# EAGLE design ECAM03 (EAGLE 7.4.0)
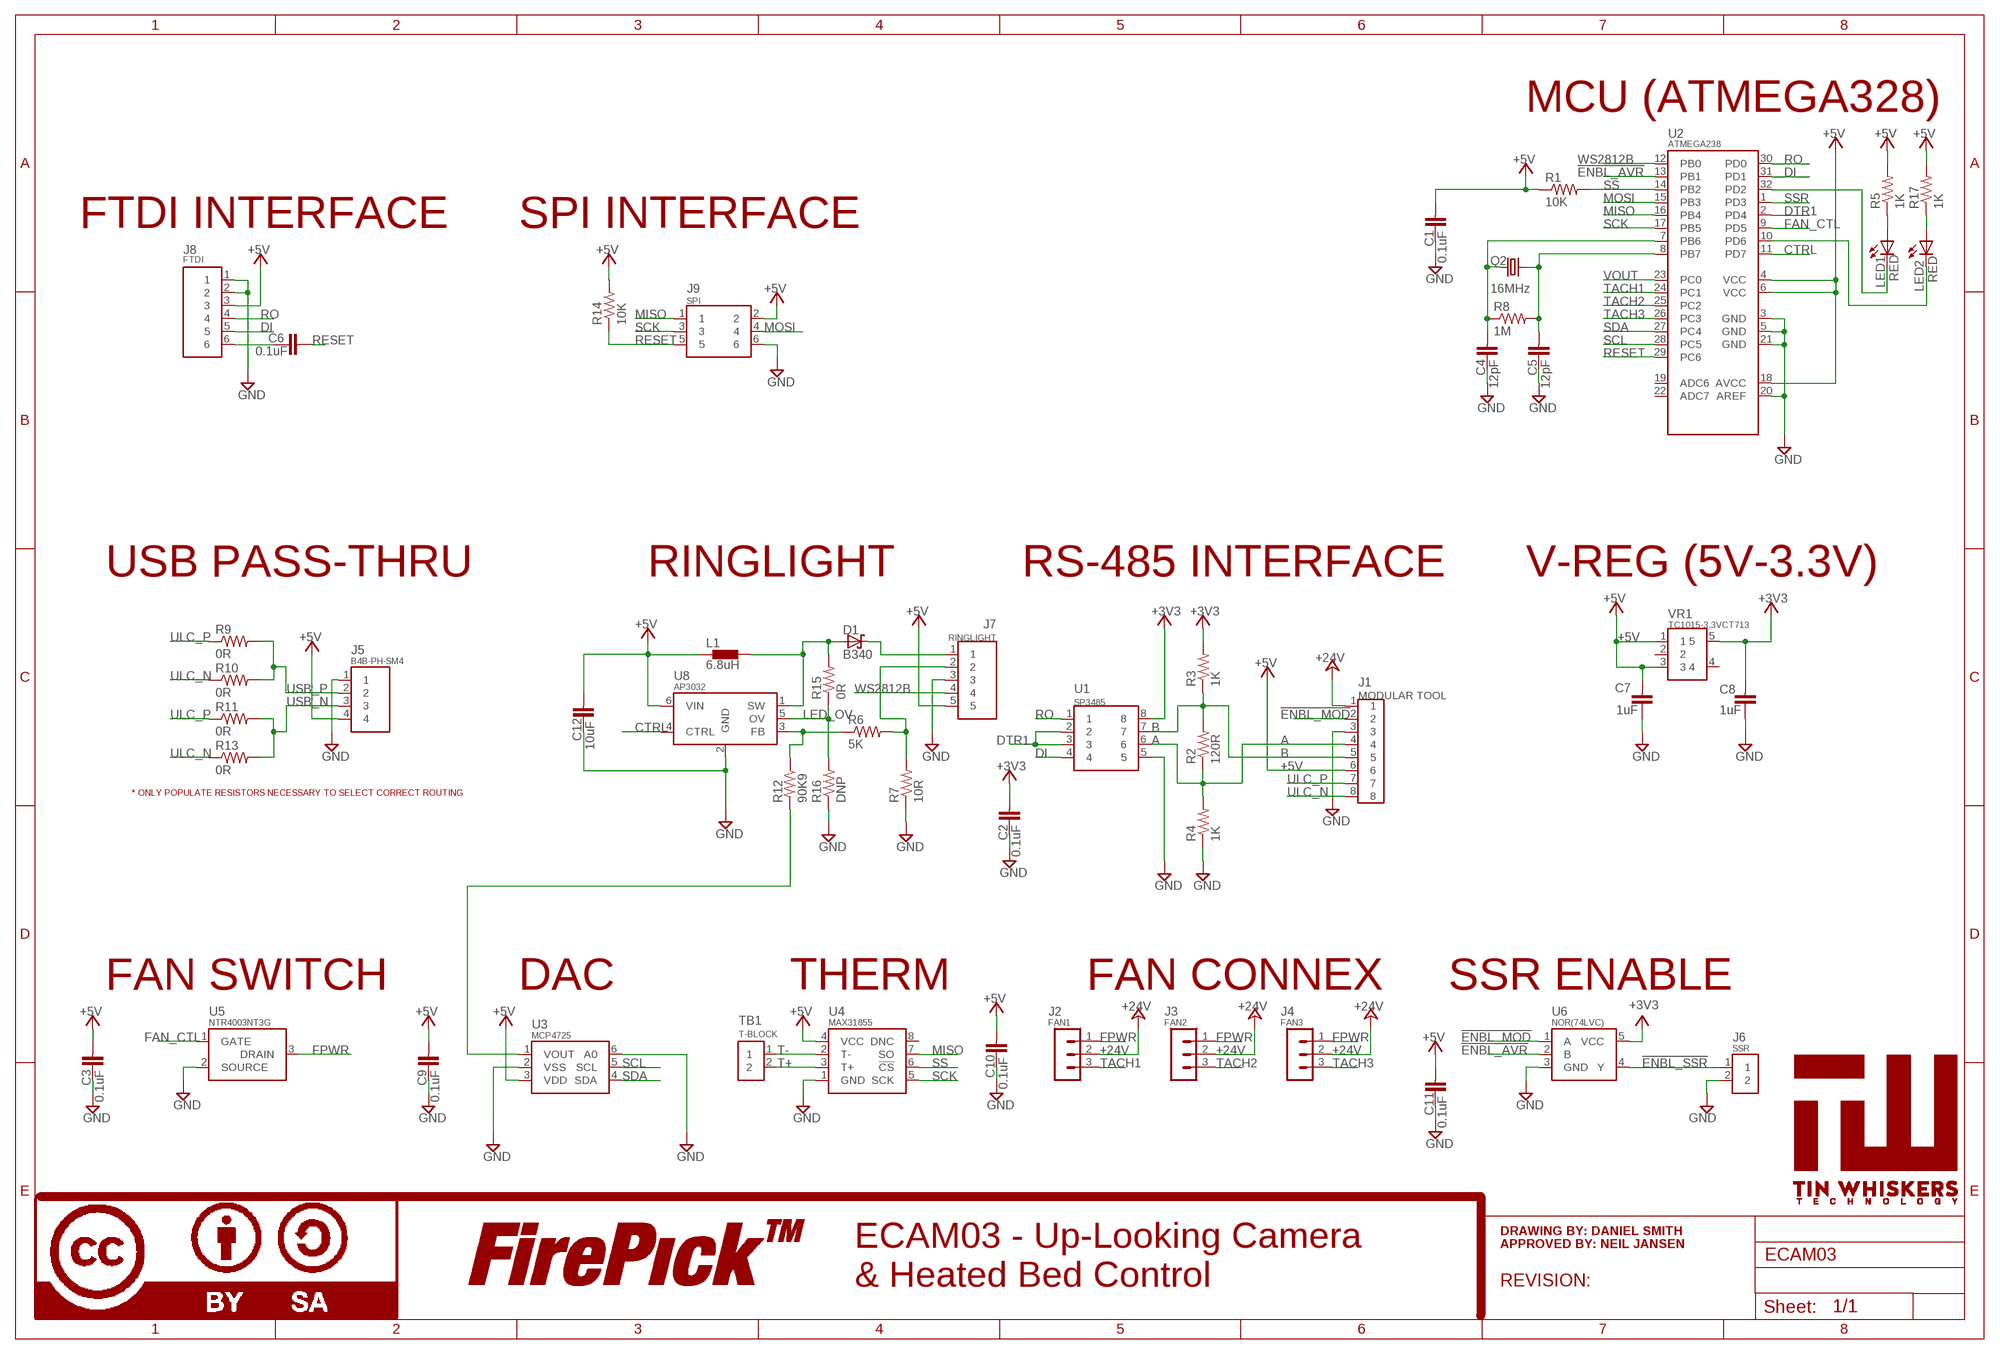
[diagram p0: schematic, sheet 1]

## Parts
C1  0.1uF  CPL-CAP-X5R-0603-0.1UF-35V  [C0603]
C2  0.1uF  CPL-CAP-X5R-0603-0.1UF-35V  [C0603]
C3  0.1uF  CPL-CAP-X5R-0603-0.1UF-35V  [C0603]
C4  12pF  CPL-CAP-C0G-0603-12PF-50V  [C0603]
C5  12pF  CPL-CAP-C0G-0603-12PF-50V  [C0603]
C6  0.1uF  CPL-CAP-X7R-0603-100NF-50V  [C0603]
C7  1uF  CPL-CAP-X5R-0603-1UF-50V  [C0603]
C8  1uF  CPL-CAP-X5R-0603-1UF-50V  [C0603]
C9  0.1uF  CPL-CAP-X5R-0603-0.1UF-35V  [C0603]
C10  0.1uF  CPL-CAP-X5R-0603-0.1UF-35V  [C0603]
C11  0.1uF  CPL-CAP-X5R-0603-0.1UF-35V  [C0603]
C12  10uF  CPL-CAP-X5R-0603-10UF-25V  [C0603]
D1  B340  CPL-DIO-B340-13-F-SMA  [DIO-SMA]
J1  MODULAR TOOL  CPL-CON-JST-2.0MM-8P-M-RA  [CONN-JST-PH-2.0MM-8P-SMT-RA]
J2  FAN1  CONN-RECT-3PINMOLEX-KK  [CONN-MOLEX-KK-3PIN]
J3  FAN2  CONN-RECT-3PINMOLEX-KK  [CONN-MOLEX-KK-3PIN]
J4  FAN3  CONN-RECT-3PINMOLEX-KK  [CONN-MOLEX-KK-3PIN]
J5  B4B-PH-SM4  CPL-CON-JST-2.0MM-4P-M-SMT-VRT  [CON-JST-PH-2.0MM-4P-SMT-VRT]
J6  SSR  CPL-CON-HEADER-0.1IN-2P-M  [CON-HDR-2POS-MALE]
J7  RINGLIGHT  CPL-CON-JST-2.0MM-5P-SMT-VRT  [CON-JST-PH-2.0MM-5P-SMT-VRT]
J8  FTDI  CPL-CON-HEADER-0.1IN-6P-M  [CON-HDR-6POS-MALE]
J9  SPI  CPL-CON-HEADER-0.1IN-2X3P-M  [CON-HDR-2X3P]
L1  6.8uH  CPL-IND-6.8UH-250MA  [0603]
LED1  RED  CPL-LED-0603-RED  [LED0603]
LED2  RED  CPL-LED-0603-RED  [LED0603]
LOGO1  LOGO-CC-BY-SALARGE  [LOGO-CC-BY-SA]
LOGO2  LOGO-FIREPICKLARGE  [LOGO-FIREPICK]
Q2  16MHz  CPL-OSC-CRY-16MHZ-18PF  [HC-49/U-S]
R1  10K  CPL-RES-0603-10K-0.1W  [R0603]
R2  120R  CPL-RES-0603-120-0.1W  [R0603]
R3  1K  CPL-RES-0603-1K-0.1W  [R0603]
R4  1K  CPL-RES-0603-1K-0.1W  [R0603]
R5  1K  CPL-RES-0603-1K-0.1W  [R0603]
R6  5K  CPL-RES-0603-5K-0.1W  [R0603]
R7  10R  CPL-RES-1206-10-0.25W1206  [R1206]
R8  1M  CPL-RES-0603-1M-0.1W  [R0603]
R9  0R  CPL-RES-0603-0-0.1W  [R0603]
R10  0R  CPL-RES-0603-0-0.1W  [R0603]
R11  0R  CPL-RES-0603-0-0.1W  [R0603]
R12  90K9  CPL-RES-0603-90K-0.1W  [R0603]
R13  0R  CPL-RES-0603-0-0.1W  [R0603]
R14  10K  CPL-RES-0603-10K-0.1W  [R0603]
R15  0R  CPL-RES-0603-0-0.1W  [R0603]
R16  DNP  CPL-RES-0603-0-0.1W  [R0603]
R17  1K  CPL-RES-0603-1K-0.1W  [R0603]
TB1  T-BLOCK  CPL-TBLK-SCR-2CKT-5.0MM-OST  [TBLOCK-2-5MM-OSTTH020160]
U1  SP3485  [SOICN-8]
U2  ATMEGA238  CPL-MCU-ATMEL-AT328-32TQFP  [32-TQF(ATMEGA)]
U3  MCP4725  CPL-DAC-12BIT-SOT23  [SOT-23-6]
U4  MAX31855  CPL-THRM-MAX31855  [SOICN-8]
U5  NTR4003NT3G  CPL-MOSFET-NCH-SOT23NTR4003N  [SOT-23-3]
U6  NOR(74LVC)  CPL-IC-LOGIC-NOR-1CH-74LVC  [SOT-23-5]
U8  AP3032  CPL-LED-DRIVER-WHT-AP3032  [SOT-23-6]
U$1  TIN-WHISKERSTSTOP  [TIN-WHISKERS-TSTOP]
VR1  TC1015-3.3VCT713  CPL-REG-LIN-3.3V-0.1A  [SOT-23-5]

## Nets
!ENBL_AVR: U2.13(PB1) U6.2(B)
!ENBL_MOD: J1.2 U6.1(A)
!ENBL_SSR: J6.1 U6.4(Y)
+3V3: C2.2 C8.2 R3.2 U1.8 U6.5(VCC) VR1.5
+5V: C1.2 C3.2 C7.2 C9.2 C10.2 C11.2 C12.2 J1.6 J5.4 J7.5 J8.3 J9.2 L1.1 R1.1 R5.2 R14.2 R17.2 U2.4(VCC) U2.6(VCC) U2.18(AVCC) U3.3(VDD) U4.4(VCC) U8.6(VIN) VR1.1 VR1.3
+24V: J1.1 J2.2 J3.2 J4.2
A: J1.4 R2.1 R4.2 U1.6
B: J1.5 R2.2 R3.1 U1.7
CTRL: U2.11(PD7) U8.4(CTRL)
DI: J8.5 U1.4 U2.31(PD1)
DTR1: U1.2 U1.3 U2.2(PD4)
FAN_CTL: U2.9(PD5) U5.1(GATE)
FPWR: J2.1 J3.1 J4.1 U5.3(DRAIN)
GND: C1.1 C2.1 C3.1 C4.1 C5.1 C7.1 C8.1 C9.1 C10.1 C11.1 C12.1 J1.3 J5.1 J6.2 J7.3 J8.1 J8.2 J9.6 R4.1 R7.1 R16.1 U1.5 U2.3(GND) U2.5(GND) U2.20(AREF) U2.21(GND) U3.2(VSS) U3.6(A0) U4.1(GND) U5.2(SOURCE) U6.3(GND) U8.2(GND)
LED_+: D1.NEG(C) J7.1
LED_-: J7.2 R6.2 R7.2
LED_FB: R6.1 R12.1 U8.3(FB)
LED_OV: R15.1 R16.2 U8.5(OV)
LED_SW: D1.POS(A) L1.2 R15.2 U8.1(SW)
MISO: J9.1 U2.16(PB4) U4.7(SO)
MOSI: J9.4 U2.15(PB3)
N$1: LED2.A R17.1
N$2: LED1.A R5.1
N$3: LED1.C U2.32(PD2)
N$4: LED2.C U2.10(PD6)
N$5: R12.2 U3.1(VOUT)
N$16: C6.1 J8.6
RESET: C6.2 J9.5 R14.1 U2.29(PC6)
RO: J8.4 U1.1 U2.30(PD0)
SCK: J9.3 U2.17(PB5) U4.5(SCK)
SCL: U2.28(PC5) U3.5(SCL)
SDA: U2.27(PC4) U3.4(SDA)
SS: R1.2 U2.14(PB2) U4.6(!CS)
SSR: U2.1(PD3)
T+: TB1.2 U4.3(T+)
T-: TB1.1 U4.2(T-)
TACH1: J2.3 U2.24(PC1)
TACH2: J3.3 U2.25(PC2)
TACH3: J4.3 U2.26(PC3)
ULC_N: J1.8 R10.1 R13.1
ULC_P: J1.7 R9.1 R11.1
USB_N: J5.3 R11.2 R13.2
USB_P: J5.2 R9.2 R10.2
VOUT: U2.23(PC0)
WS2812B: J7.4 U2.12(PB0)
XTAL1: C4.2 Q2.1 R8.1 U2.7(PB6)
XTAL2: C5.2 Q2.2 R8.2 U2.8(PB7)
Unconnected: U2.19(ADC6) U2.22(ADC7) U4.8(DNC) VR1.2 VR1.4

## Notes on the sheet
- MCU (ATMEGA328)
- FTDI INTERFACE | SPI INTERFACE
- SPI
- USB PASS-THRU | RINGLIGHT | RS-485 INTERFACE | V-REG (5V-3.3V)
- * ONLY POPULATE RESISTORS NECESSARY TO SELECT CORRECT ROUTING
- FAN SWITCH | DAC | THERM | FAN CONNEX | SSR ENABLE
- DRAWING BY: DANIEL SMITH
- APPROVED BY: NEIL JANSEN
- ECAM03 - Up-Looking Camera
  & Heated Bed Control
- REVISION:

## Library data of the parts
C1-C3 C9-C11 = TinWhiskers:CPL-CAP-X5R-0603-0.1UF-35V: Capacitor: 0.1uF, 35V, 10%, X5R; Package: 0603; Datasheet: http://www.yuden.co.jp/productdata/catalog/en/mlcc01_hq_e.pdf
C4 C5 = TinWhiskers:CPL-CAP-C0G-0603-12PF-50V: Capacitor: 12pF, 50V, 5%; Package: 0603; Datasheet: http://download.siliconexpert.com/pdfs/2011/4/6/10/1/57/701/samelm_/manual/cl10c120jb8nnnc.pdf; PARTNO: GRM1885C1H120FA01J
C6 = TinWhiskers:CPL-CAP-X7R-0603-100NF-50V: Capacitor: 100nF, 50V, 10%; Package: 0603; PARTNO: UMK107B7104KA-T
C7 C8 = TinWhiskers:CPL-CAP-X5R-0603-1UF-50V: Capacitor: 1uF, 50V, 10%; Package: 0603; Datasheet: http://www.mouser.com/ds/2/396/mlcc_all_e-541559.pdf; PARTNO: UMK107AB7105KA-T
C12 = TinWhiskers:CPL-CAP-X5R-0603-10UF-25V: Capacitor: 10uF, 16V, 20%, X5R; Package: 0603; Datasheet: http://www.murata.com/~/media/webrenewal/support/library/catalog/products/capacitor/mlcc/c02e.ashx; PARTNO: GRM188R61C106MA73D
D1 = TinWhiskers:CPL-DIO-B340-13-F-SMA: Diode: B340-13-F (Rectifier, Shottky), Vrrm=40V, If=3A Package: SMA Datasheet: http://www.mouser.com/ds/2/115/ds30891-89887.pdf; PARTNO: B340A-13-F
J1 = TinWhiskers:CPL-CON-JST-2.0MM-8P-M-RA: Connector: 2.0mm Pitch, 8-POS, Pin, Shrouded; Package: HR-Series (SMT, R/A); Datasheet: http://www.jst-mfg.com/product/pdf/eng/ePH.pdf; PARTNO: S8B-PH-SM4-TB(LF)(SN)
J2-J4 = FirePick:CONN-RECT-3PIN; PARTNO: 22232031
J5 = TinWhiskers:CPL-CON-JST-2.0MM-4P-M-SMT-VRT: Connector: 2.0MM Pitch, 2-Pin; Package: SMT, Vertical; Datasheet: http://www.jst-mfg.com/product/pdf/eng/ePH.pdf; PARTNO: B4B-PH-SM4-TB(LF)(SN)
J6 = TinWhiskers:CPL-CON-HEADER-0.1IN-2P-M: Connector: Header, 2-P, 0.1" Pitch; PARTNO: 68000-102HLF
J7 = TinWhiskers:CPL-CON-JST-2.0MM-5P-SMT-VRT: Connector: 2.0MM Pitch, 2-Pin; Package: SMT, Vertical; Datasheet: http://www.jst-mfg.com/product/pdf/eng/ePH.pdf; PARTNO: B5B-PH-SM4-TB(LF)(SN)
J8 = TinWhiskers:CPL-CON-HEADER-0.1IN-6P-M: Connector: Header, 0.1"-Pitch, 6-Pos, Pins (Male); PARTNO: S6B-PH-SM4-TB(LF)(SN)
J9 = TinWhiskers:CPL-CON-HEADER-0.1IN-2X3P-M: Connector: 0.1" Pitch, 2x3P Datasheet: http://www.mouser.com/ds/2/418/NG_CD_825440_G_baseFilename-672958.pdf; PARTNO: 67996-206HLF
L1 = TinWhiskers:CPL-IND-6.8UH-250MA: Inductor: 6.8uH, 20%, 250mA; Packages: 0603; Datasheet: http://ds.yuden.co.jp/TYCOMPAS/ut/detail.do?productNo=BRL1608T6R8M&fileName=BRL1608T6R8M_SS&mode=specSheetDownload; PARTNO: BRL1608T6R8M
LED1 LED2 = TinWhiskers:CPL-LED-0603-RED: LED: Red; Package: 0603
LOGO1 = FirePick:LOGO-CC-BY-SA; BOM: EXCLUDE; DNP: T
LOGO2 = FirePick:LOGO-FIREPICK; BOM: EXCLUDE; DNP: T
Q2 = TinWhiskers:CPL-OSC-CRY-16MHZ-18PF: Crystal Oscillator: 16MHz, 18pF, 50 Ohm (ESR); Package: HC-49/US; Datasheet: http://cfm.citizen.co.jp/english/product/pdf/HCM49.pdf; PARTNO: HCM4916000000ABJT
R1 R14 = TinWhiskers:CPL-RES-0603-10K-0.1W: Resistor: 10kOhm, 0.1W, 1%; Package: 0603; Datasheet: http://www.mouser.com/ds/2/315/AOA0000CE2-37512.pdf; PARTNO: RC0603FR-0710KL
R2 = TinWhiskers:CPL-RES-0603-120-0.1W: Resistor: 120 Ohm, 0.1W, 1%; Package: 0603 (SMT); Datasheet:; PARTNO: RC0603FR-07120RL
R3 R4 = TinWhiskers:CPL-RES-0603-1K-0.1W: Resistor: 1 kOhm, 0.1W, 1%; Package: 0603; Datasheet: http://www.yageo.com/NewPortal/yageodocoutput?fileName=/pdf/R-Chip/PYu-RC_Group_51_RoHS_L_3.pdf; PARTNO: RC0603FR-071KL
R5 R17 = TinWhiskers:CPL-RES-0603-1K-0.1W: Resistor: 1 kOhm, 0.1W, 1%; Package: 0603; Datasheet: http://www.yageo.com/NewPortal/yageodocoutput?fileName=/pdf/R-Chip/PYu-RC_Group_51_RoHS_L_3.pdf
R6 = TinWhiskers:CPL-RES-0603-5K-0.1W: Resistor: 5.0 kOhm, 0.15W, 0.1%; Package: 0603; Datasheet: http://www.vishay.com/docs/60057/pnm.pdf; PARTNO: RC0603FR-074K99L
R7 = TinWhiskers:CPL-RES-1206-10-0.25W; PARTNO: RC1206FR-0710RL
R8 = TinWhiskers:CPL-RES-0603-1M-0.1W: Resistor: 1MOhm, 0.1W, 5%; Package: 0603; Datasheet: http://www.samsungsem.com/global/support/library/product-catalog/__icsFiles/afieldfile/2015/01/12/CHIP_RESISTOR_150112_1.pdf; PARTNO: RC0603FR-071ML
R9-R11 R13 R15 R16 = TinWhiskers:CPL-RES-0603-0-0.1W: Resistor: 0 Ohm, 0.1W, 5%; Specs: http://www.mouser.com/ds/2/315/AOA0000CE1-37422.pdf; PARTNO: RC0603JR-070RL
R12 = TinWhiskers:CPL-RES-0603-90K-0.1W: Resistor: 90.9 kOhm, 0.1W, 1%; Package: 0603; Datasheet: http://www.yageo.com/NewPortal/yageodocoutput?fileName=/pdf/R-Chip/PYu-RC_Group_51_RoHS_L_3.pdf; PARTNO: RC0603FR-0790K9L
TB1 = TinWhiskers:CPL-TBLK-SCR-2CKT-5.0MM-OST: Terminal Block: 2-Circuit, Green, 5.0MM Pitch, Green; Package: Thru-Hole, R/A; Datasheet: http://www.on-shore.com/sites/default/files/manuals/ostthxx0160.pdf; PARTNO: OSTTH020160
U1 = TinWhiskers:SP3485: Transceiver: RS-485 Chip; Package: SOICN-8; Datasheet: http://www.exar.com/common/content/document.ashx?id=639; PARTNO: SP3485
U2 = TinWhiskers:CPL-MCU-ATMEL-AT328-32TQFP: Processor: Atmega AT328; Package: 32-TQFP; Datasheet: http://www.atmel.com/devices/atmega328.aspx; PARTNO: ATMEGA328-AUR
U3 = TinWhiskers:CPL-DAC-12BIT-SOT23: Digital-Analog Converter: 12-Bit, MPC4725; Package: SOT23-6; Datasheet: http://ww1.microchip.com/downloads/en/DeviceDoc/22039d.pdf; PARTNO: MCP4725A0T-E/CH
U4 = TinWhiskers:CPL-THRM-MAX31855: Thermocouple: Digital, 14-Bit, 8-Pin; Package: SOIC-8 (Narrow); Datasheet: http://datasheets.maximintegrated.com/en/ds/MAX31855.pdf; PARTNO: MAX31855KASA+
U5 = TinWhiskers:CPL-MOSFET-NCH-SOT23: MOSFET: N-Channel, Switching; Package: SOT23; Datasheet: http://www.onsemi.com/pub_link/Collateral/NTR4003N-D.PDF; PARTNO: NTR4003NT3G
U6 = TinWhiskers:CPL-IC-LOGIC-NOR-1CH-74LVC: Gate: Logic, NOR, 3.3V; Package: SOT23-5; Datasheet: http://www.ti.com/lit/ds/symlink/sn74lvc1g02.pdf; PARTNO: SN74LVC1G02DBVR
U8 = TinWhiskers:CPL-LED-DRIVER-WHT-AP3032: LED Driver: White, Step-Up, AP3032 (Diodes, Inc.); Package: SOT23-6; Datasheet: http://www.diodes.com/_files/datasheets/AP3032.pdf; PARTNO: AP3032KTR-G1
U$1 = !tin-whiskers-logo:TIN-WHISKERS; PARTNO: *
VR1 = TinWhiskers:CPL-REG-LIN-3.3V-0.1A: Voltage Regulator: Linear, Vmax=6, Vout=3.3V, Io=0.1mA; Package: SOT-23-5 Datasheet: http://www.mouser.com/ds/2/268/21335b-29125.pdf; PARTNO: TC1015-3.3VCT713

## Board
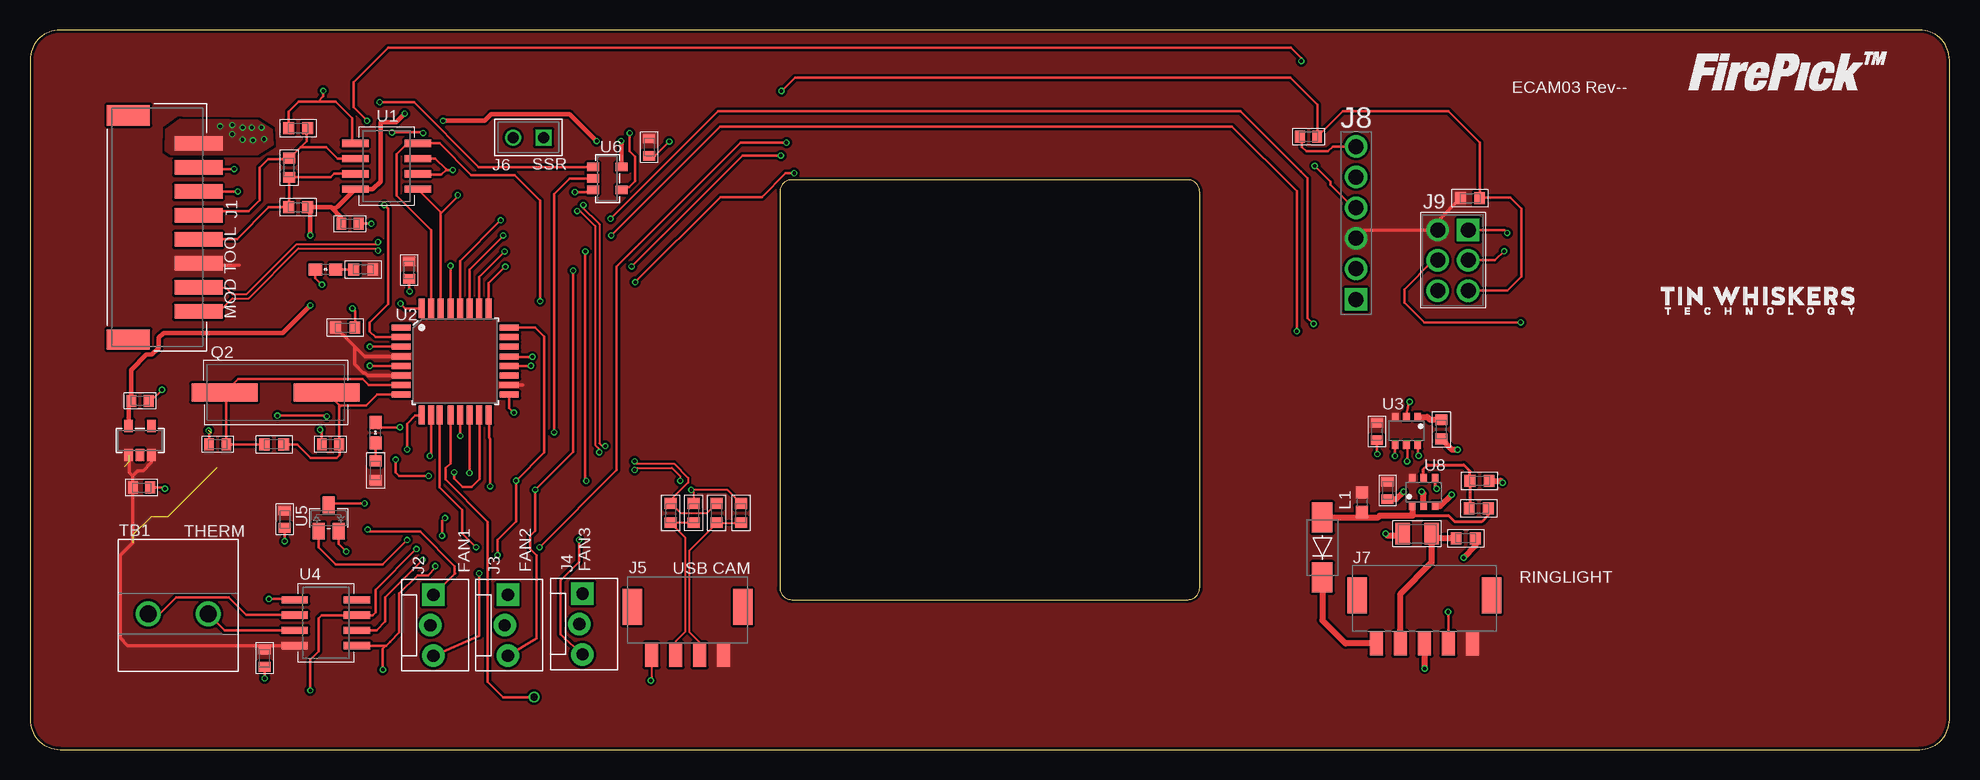
[diagram p1: board, top side]
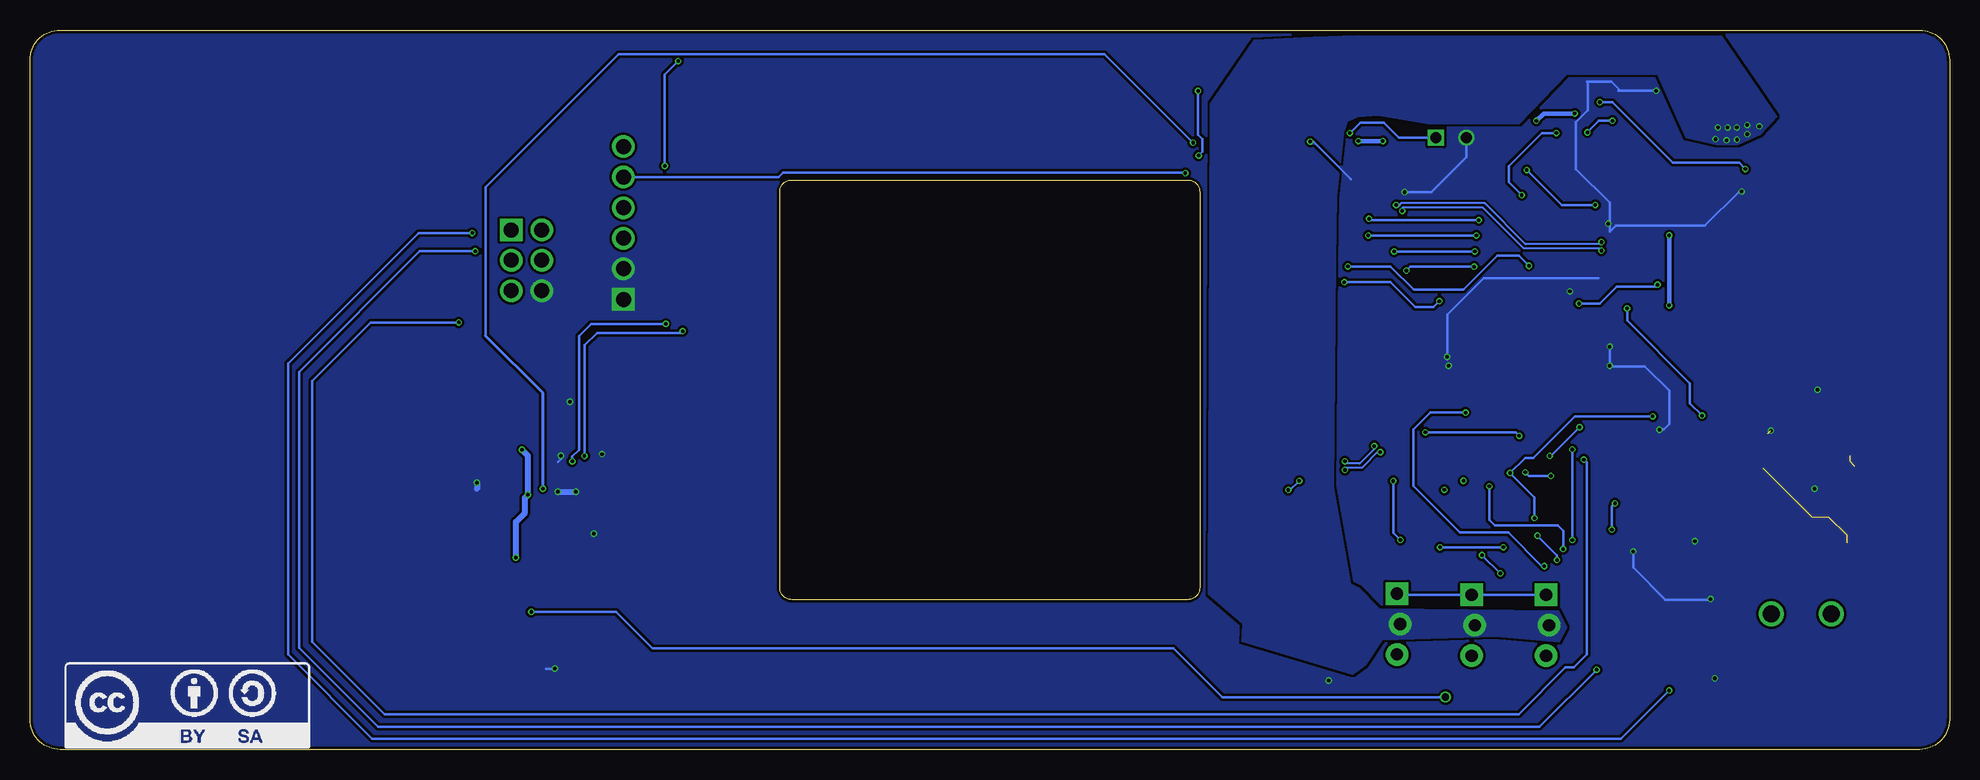
[diagram p2: board, bottom side, seen from below]

Size 160 x 60 mm. Coordinates in mm from the lower left corner, seen from the top.
Outline: 2.5,0 157.5,0 arc90 160,2.5 160,57.5 arc90 157.5,60 2.5,60 arc90 0,57.5 0,2.5 arc90 2.5,0
Outline: 63.5,12.5 96.5,12.5 arc90 97.5,13.5 97.5,46.5 arc90 96.5,47.5 63.5,47.5 arc90 62.5,46.5 62.5,13.5 arc90 63.5,12.5
Copper layers (1*2*15*16): Top 0.035mm / dielectric 0.2mm / Route2 0.0175mm / dielectric 0.3mm / Route15 0.0175mm / dielectric 0.2mm / Bottom 0.035mm
Design rules "HQPCB_4layer_DRU_no_angle": minimum track width 6mil, minimum drill 12mil, track to track 8mil, track to pad 8mil, pad to pad 6mil, via to via 8mil, smd to smd 0mil, copper to edge 10mil, drill to drill 8mil, minimum pad ring 6mil, minimum via ring 4mil, stop-mask expansion 2mil, vias tented up to drill 100mil, thermal gap 10mil
tKeepout: area 0,0 to 160,6; area 0,0 to 6,60; area 0,54 to 160,60; area 154,0 to 160,60

### Footprints (pad centres in the part's own frame; a part is rotated, then mirrored left to right if it is on the bottom)
C0603 = smd 0.8 x 1: 1 -0.725,0; 2 0.725,0
DIO-SMA = smd 2.505 x 1.7: NEG 2.5,0; POS -2.5,0
CONN-JST-PH-2.0MM-8P-SMT-RA = smd 1.2 x 4: 1 7,0; 2 5,0; 3 3,0; 4 1,0; 5 -1,0; 6 -3,0; 7 -5,0; 8 -7,0 | smd 1.7 x 3.6: NC1 9.35,5.85; NC2 -9.35,5.85
CONN-MOLEX-KK-3PIN = drill 1.016 pad 1.88 square: 1 -2.54,0.127 | drill 1.016 pad 1.88: 2 0,-0.127; 3 2.54,0.127
CON-JST-PH-2.0MM-4P-SMT-VRT = smd 1.1 x 2: 1 -3,0; 2 -1,0; 3 1,0; 4 3,0 | smd 1.6 x 3: NC1 -4.6,4; NC2 4.6,4
CON-HDR-2POS-MALE = drill 0.9 square: 1 -1.27,0 | drill 0.9: 2 1.27,0
CON-JST-PH-2.0MM-5P-SMT-VRT = smd 1.1 x 2: 1 -4,0; 2 -2,0; 3 0,0; 4 2,0; 5 4,0 | smd 1.6 x 3: NC1 -5.6,4; NC2 5.6,4
CON-HDR-6POS-MALE = drill 1.25 square: 1 -6.35,0 | drill 1.25: 2 -3.8,0; 3 -1.26,0; 4 1.28,0; 5 3.85,0; 6 6.39,0
CON-HDR-2X3P = drill 1.25 square: 1 -2.54,1.27 | drill 1.25: 2 -2.54,-1.27; 3 0,1.27; 4 0,-1.27; 5 2.54,1.27; 6 2.54,-1.27
0603 = smd 1 x 1: 1 -0.8,0; 2 0.8,0
LED0603 = smd 1.1 x 1: A -0.85,0; C 0.85,0
HC-49/U-S = smd 5.5 x 1.5: 1 -4.25,0; 2 4.25,0
R0603 = smd 0.9 x 1: 1 -0.8,0; 2 0.8,0
R1206 = smd 1.2 x 1.8: 1 -1.2,0; 2 1.2,0
TBLOCK-2-5MM-OSTTH020160 = drill 1.4: 1 -2.5,0; 2 2.5,0
SOICN-8 = smd 2.2 x 0.6: 1 -2.6,1.905; 2 -2.6,0.635; 3 -2.6,-0.635; 4 -2.6,-1.905; 5 2.6,-1.905; 6 2.6,-0.635; 7 2.6,0.635; 8 2.6,1.905
32-TQF(ATMEGA) = smd 1.6 x 0.5: 1 -4.5,2.8; 2 -4.5,2; 3 -4.5,1.2; 4 -4.5,0.4; 5 -4.5,-0.4; 6 -4.5,-1.2; 7 -4.5,-2; 8 -4.5,-2.8; 17 4.5,-2.8; 18 4.5,-2; 19 4.5,-1.2; 20 4.5,-0.4; 21 4.5,0.4; 22 4.5,1.2; 23 4.5,2; 24 4.5,2.8 | smd 0.5 x 1.6: 9 -2.8,-4.5; 10 -2,-4.5; 11 -1.3,-4.5; 12 -0.4,-4.5; 13 0.4,-4.5; 14 1.2,-4.5; 15 2,-4.5; 16 2.8,-4.5; 25 2.8,4.4; 26 2,4.4; 27 1.2,4.4; 28 0.4,4.4; 29 -0.4,4.4; 30 -1.2,4.4; 31 -2,4.4; 32 -2.8,4.4
SOT-23-6 = smd 0.55 x 0.65: 1 0.95,1.175; 2 0,1.175; 3 -0.95,1.175; 4 -0.95,-1.175; 5 0,-1.175; 6 0.95,-1.175
SOT-23-3 = smd 1 x 1.4: 1 -0.85,-1.1; 2 0.85,-1.1; 3 0,1.1
SOT-23-5 = smd 0.7 x 1: 1 0.95,1.2; 2 0,1.2; 3 -0.95,1.2; 4 -0.95,-1.2; 5 0.95,-1.2

### Placement (x,y rotation side)
C1  31.6,39.98 90 top
C2  26.67,43.84 180 top
C3  21.23,19.2 90 top
C4  15.65,25.45 0 top
C5  25.04,25.45 0 top
C6  106.58,51.1 0 top
C7  9.3,21.84 180 top
C8  9.17,29.08 180 top
C9  112.27,26.52 90 top
C10  19.56,7.62 90 top
C11  51.61,50.24 90 top
C12  113.16,21.6 90 top
D1  107.72,16.84 270 top
J1  14.05,43.54 90 top
J2  33.5,10.36 270 top
J3  39.7,10.36 270 top
J4  45.92,10.46 270 top
J5  54.81,7.89 0 top
J6  41.54,51.03 180 top
J7  116.23,8.84 0 top
J8  110.54,43.89 90 top
J9  118.62,40.79 270 top
L1  111.02,20.62 270 top
LED1  24.64,40.03 180 top
LED2  28.8,26.42 90 top
LOGO1  157.1,0.13 0 bottom
LOGO2  138.05,53.21 0 top
Q2  20.47,29.77 0 top
R1  26.29,35.18 0 top
R2  21.59,48.51 270 top
R3  22.35,45.21 0 top
R4  22.35,51.82 0 top
R5  27.79,40.03 0 top
R6  119.67,17.61 180 top
R7  115.62,17.98 0 top
R8  20.35,25.45 0 top
R9  53.42,19.71 270 top
R10  55.32,19.71 270 top
R11  57.23,19.71 270 top
R12  117.63,26.7 90 top
R13  59.26,19.71 270 top
R14  120.04,45.97 180 top
R15  120.76,20.11 0 top
R16  120.83,22.41 180 top
R17  28.8,23.27 270 top
TB1  12.36,11.32 0 top
U1  29.72,48.64 180 top
U2  35.45,32.38 0 top
U3  114.73,26.57 0 top
U4  24.66,10.57 0 top
U5  24.89,19.3 0 top
U6  48.13,47.62 90 top
U8  116.16,21.48 180 top
U$1  136.3,35.76 0 top
VR1  9.17,25.78 180 top

### Tracks (layer width: path | path; a pad name or v marks a point on that pad's centre or on a via)
!ENBL_AVR  (via drill 0.3)
  Top 0.203: U6.2 44.98,47.62 43.69,46.33 v43.69,26.45 | v35.87,26.16 35.87,27.87 U2.13
  Bottom 0.203: v43.69,26.45 36.16,26.45 v35.87,26.16
!ENBL_MOD  (via drill 0.3)
  Top 0.203: U6.1 37.4,48.58 32,53.98 v29.15,53.98 | 14.06,48.68 J1.2 14.17,48.41 v17.02,48.41
  Bottom 0.203: v29.15,53.98 28.12,53.98 23.06,48.92 17.53,48.92 v17.02,48.41
!ENBL_SSR  (via drill 0.3)
  Top 0.203: 49.66,46.67 U6.4 49.55,46.89 49.94,46.89 50.44,47.4 50.44,49.43 49.99,49.89 v49.99,51.41
  Bottom 0.203: J6.1 45.9,51.03 47.14,52.27 49.12,52.27 v49.99,51.41
+3V3  (via drill 0.3)
  Top 0.203: 25.09,45.21 25.59,45.21 | 49.33,50.68 v49.28,50.74 | 23.37,45 R3.2
  Top 0.305: 8.22,28.86 C8.2
  Top 0.381: VR1.5 8.22,28.86 | C8.2 8.44,31.66 9.7,32.92 10.16,32.92 10.72,33.48 10.72,34.34 11.12,34.75 21.08,34.75 v23.37,37.03 | R3.2 25.09,45.21 25.95,44.36 C2.2 | 25.59,45.21 U1.8 28.57,46.74 29.21,47.37 29.21,52.32 30.53,52.32 v31.24,53.03 | U6.5 49.33,50.68 | v47.24,50.74 45,52.98 38.46,52.98 37.9,52.43 v34.44,52.43 | v23.37,42.88 23.37,45
  Bottom 0.381: v49.28,50.74 v47.24,50.74 | v23.37,37.03 v23.37,42.88 | v31.24,53.03 33.83,53.03 v34.44,52.43
+5V  (6 unrouted)
  Top 0.305: U3.3 113.78,27.9 | 8.57,22.82 C7.2 8.57,17.23 7.52,16.18 7.52,9.3 8.15,8.66 U4.4 | 8.57,22.82 8.28,23.11 8.28,24.52 VR1.1 | VR1.3 10.12,23.94 9.42,23.24 8.99,23.24 8.57,22.82 | U2.4 27.88,32.78 27.05,33.62 | 27.05,33.62 R1.1 | U2.6 28.15,31.18 27.94,31.39 27.79,31.39 27.05,32.13 27.05,33.62 | U2.18 41.05,30.39 | 17.42,40.39 14.2,40.39 J1.6 | J8.3 111.24,43.33 J9.2 117.35,44.08 R14.2
  pour Top (rank 3, no thermals): 0,60 160,60 160,0.25 0,0
+24V  (via drill 0.3)
  other vias: 18.58,50.8 18.49,51.87 19.3,51.87 19.51,50.9 17.73,51.87 17.72,50.85 16.85,51.31 16.87,52.07 15.85,51.97
  pour Bottom (rank 2, no thermals): 47.57,11.77 32.6,11.62 31.9,10.19 32.56,8.95 37.77,9.4 47.29,9.12 48.69,7.02 49.77,6.25 58.97,8.97 58.89,10.48 61.79,12.95 61.59,53.85 57.94,59.21 53.04,59.42 49.34,59.56 19.04,59.51 14.38,52.76 15.82,51.22 17.67,50.39 19.38,50.39 21.95,50.99 24.32,56.26 31.94,56.26 35.88,52.13 43.43,52.13 47.65,52.84 49.3,52.73 50.23,52.32 50.53,51.3 51.12,46.1 51.18,40.83 51.35,21.86 49.94,13.86 49.26,13.53
  pour Top (rank 2, no thermals): 16.59,52.55 18.94,52.54 20.19,51.74 20.26,50.41 18.95,49.57 11.76,49.57 11.25,49.89 11.32,51.73 12.52,52.62
A
  Top 0.203: 22.54,50.23 21.63,49.31 R2.1 21.49,49.21 19.85,49.21 19.15,48.51 19.15,45.82 18.24,44.91 14.42,44.91 J1.4 | 22.54,50.23 23.05,50.74 23.05,51.72 R4.2 | U1.6 25.65,49.28 24.7,50.23 22.54,50.23
B
  Top 0.203: U1.7 25.34,48.01 25.04,47.71 R2.2 21.59,45.25 R3.1 19.91,45.21 17.27,42.57 14.08,42.57 J1.5
CTRL  (via drill 0.3)
  Top 0.203: v63.06,50.61 59.24,50.61 48.9,40.26 48.9,23.29 v42.47,16.87 | v37.19,16.87 36.02,18.03 36.02,19.96 34.14,21.84 34.14,27.88 U2.11
  Top 0.254: U8.4 117.11,21.89 v117.25,21.75
  Bottom 0.203: v63.06,50.61 70.42,57.98 110.93,57.98 122.03,46.88 122.03,34.5 | v42.47,16.87 v37.19,16.87
  Bottom 0.254: v117.25,21.75 117.25,29.72 122.03,34.5
DI  (via drill 0.3)
  Top 0.203: U2.31 33.45,43.31 30.58,46.18 30.58,49.63 31.5,50.55 U1.4 34.14,50.55 36.78,47.9 40.39,47.9 42.52,45.77 v42.52,37.39 | v63.7,48.06 62.99,48.06 61.01,46.08 57.56,46.08 v50.44,38.96
  Bottom 0.203: J8.5 97.6,47.74 97.23,48.11 63.75,48.11 v63.7,48.06 | v50.44,38.96 46.58,38.96 44.5,36.88 43.03,36.88 v42.52,37.39
DTR1  (via drill 0.3)
  Top 0.203: U1.3 33.78,49.28 34.67,48.39 34.67,48.32 | 34.67,48.32 34.29,47.94 32.38,47.94 U1.2 | U2.2 28.8,34.38 28.32,34.86 28.32,35.62 29.84,37.15 29.84,45.09 v29.53,45.4 | v35.24,48.32 34.67,48.32
  Bottom 0.203: v29.53,45.4 32.32,45.4 v35.24,48.32
FAN_CTL  (via drill 0.3)
  Top 0.203: U5.1 24.04,16.85 25.46,15.43 29.4,15.43 v31.43,17.46 | v31.43,25.02 31.43,27.16 32.11,27.84 32.6,27.84 U2.9
  Bottom 0.203: v31.43,17.46 v31.43,25.02
FPWR  (via drill 0.3)
  Top 0.203: 24.85,20.45 U5.3 25.01,20.52 v27.89,20.52 | v28.14,18.34 28.3,18.19 32.51,18.19 35.41,15.29 35.41,14.73 35.43,14.71 J2.1
  Bottom 0.203: v28.14,18.34 28.14,20.27 v27.89,20.52 | J2.1 J3.1 45.95,12.9 J4.1
GND  (via drill 0.3)  (1 unrouted)
  Top 0.152: J5.1 51.81,5.81 v51.75,5.75
  Top 0.203: U2.5 28.34,31.98 v28.32,32 | C4.1 14.92,26.56 v14.88,26.59 | U2.3 v28.33,33.59 v28.32,33.59 | R4.1 21.55,53.17 22.42,54.04 24,54.04 | 24,54.04 25.46,54.04 26.86,52.64 26.86,50.8 U1.5 | v24.45,54.93 24.45,54.48 24,54.04 | U2.21 40.43,32.78 40.47,32.75 v41.87,32.75 | 40.18,31.98 U2.20 39.96,32 v41.75,32 | U5.2 25.74,17.13 v26.36,16.51 | v19.91,12.55 21.99,12.55 U4.1 | v45.41,46.48 46.74,46.48 U6.3 | J1.3 v17.32,46.54 v17.32,46.53 | v24.18,26.67 24.32,26.53 C5.1 | 114.71,27.72 114.96,28.96 v115,29 | U3.6 115.68,24.57 v115.75,24.5 | 116.23,6.77 v116.25,6.75 | C8.1 10.08,29.08 v11,30 | C7.1 11.16,21.84 v11.25,21.75 | C1.1 31.6,38.25 v31.65,38.2 | C2.1 v28.45,43.84 | C3.1 v21.23,17.37 | C9.1 112.27,24.69 v112.32,24.64 | C10.1 v19.56,5.94 | C11.1 52.11,49.52 v53.29,50.7
  Top 0.254: U3.2 114.71,27.72 | U3.6 115.67,25.4
  Top 0.5: J7.3 116.23,6.77 | R16.1 122.59,22.41 v122.75,22.25 | C12.1 113.88,20.88 v114.5,21.5 | U8.2 116.16,21.34 v116,21.5 | R7.1 113.82,17.82
  Top 0.508: 113.82,17.82 113.18,17.82 v113,18
  Bottom 0.203: v28.32,33.59 v28.32,32 28.27,31.95 25.4,31.95 23.37,29.92 23.37,27.13 23.82,26.67 v24.18,26.67 | 27.62,54.93 27.43,54.93 | 27.43,54.93 v24.45,54.93 | 27.43,54.93 28.19,55.69 30.23,55.69 30.16,55.63 30.16,53.3 31.14,52.32 31.14,48.41 28.32,45.59 28.32,43.18 27.81,43.69 20.38,43.69 17.54,46.53 v17.32,46.53 | 41.87,32.51 v41.87,32.75 41.87,36.26 38.82,39.31 29.27,39.31 | v26.36,16.51 26.36,15.19 23.67,12.5 19.96,12.5 v19.91,12.55 | J6.2 40.27,49.39 43.18,46.48 v45.41,46.48 | v115.75,24.5 115.75,24.25 116,24 | v116.25,6.75 117,6.75 | v53.29,50.7 53.03,50.7 49.89,47.55
  Bottom 0.5: v122.75,22.25 122.75,21.75 | v116,21.5 v114.5,21.5
  pour Bottom (rank 3, no thermals): 0,60 160,60 160,0 0,0
LED_+
  Top 0.5: J7.1 109.66,8.84 107.72,10.78 D1.NEG
LED_-
  Top 0.5: J7.2 114.23,13 116.82,15.59 R7.2 117.19,17.61 R6.2
LED_FB  (via drill 0.3)
  Top 0.5: U8.3 117.55,20.3 v118.5,21.25 | v119,25 118.52,25 R12.1 | R6.1 120.47,16.97 v119.5,16
  Bottom 0.5: v119,25 118.5,24.5 v118.5,21.25 118.75,21 118.75,19.75 119.5,19 v119.5,16
LED_OV
  Top 0.254: R15.1 120.03,20.18 R16.2 120.03,23.22 119.5,23.75 116.5,23.75 116.16,23.41 U8.5
LED_SW
  Top 0.254: 111.02,19.36 111,19.34 | R15.2 121.56,19.56 121,19 118.75,19 118.25,19.5 115.25,19.5 115.21,19.54
  Top 0.5: D1.POS 111,19.34 112.34,19.34 112.5,19.5 115.25,19.5 | L1.2 111.02,19.36 | U8.1 115.21,19.54
MISO  (via drill 0.3)
  Top 0.152: 27.24,11.18 U4.7
  Top 0.203: v38.35,21.95 38.35,25.91 38.25,26.01 U2.16 | U4.7 28.57,11.2 28.8,11.43 28.8,13.31 v32.21,16.71 | J9.1 122.89,43.33 v123.14,43.08 | v23.37,4.93 23.37,7.47 24.08,8.18 24.08,10.92 24.33,11.18 27.24,11.18
  Bottom 0.203: v32.21,16.71 32.21,18.24 32.66,18.69 37.9,18.69 38.35,19.15 v38.35,21.95 | v123.14,43.08 127.61,43.08 138.48,32.21 138.48,7.92 131.47,0.91 27.38,0.91 v23.37,4.93
MOSI  (via drill 0.3)
  Top 0.203: J9.4 116.99,40.79 114.55,38.35 114.55,37.29 116.23,35.61 v124.26,35.61 | v35.36,23.11 35.36,22.61 36.07,21.89 36.83,21.89 37.49,22.55 37.49,27.84 U2.15 | v33.22,22.81 30.79,22.81 30.48,23.11 v30.48,24.18
  Bottom 0.203: v124.26,35.61 131.62,35.61 136.5,30.73 136.5,8.99 130.45,2.95 35.92,2.95 32,6.86 31.29,6.86 30.23,7.92 30.23,23.93 v30.48,24.18 | v33.22,22.81 35.05,22.81 v35.36,23.11
N$1
  Top 0.203: LED2.A R17.1
N$2
  Top 0.203: R5.1 LED1.A
N$3  (via drill 0.3)
  Top 0.203: U2.32 31.29,36.78 v30.89,37.19 | v24.33,38.76 23.79,39.31 LED1.C
  Bottom 0.203: v30.89,37.19 29.16,37.19 27.74,38.61 24.49,38.61 v24.33,38.76
N$4  (via drill 0.3)
  Top 0.203: U2.10 33.45,24.61 v33.33,24.49 | v30.84,26.87 29.2,26.87 LED2.C
  Bottom 0.203: v33.33,24.49 33.22,24.49 v30.84,26.87
N$5
  Top 0.5: U3.1 116.48,27.74 116.73,27.5 R12.2
N$16
  Top 0.203: J8.6 108.6,50.28 108.2,49.89 106.38,49.89 106.02,50.24 106.02,50.94 C6.1
RESET  (via drill 0.3)
  Top 0.203: J9.5 123.14,38.25 124.31,39.42 124.31,45.11 123.39,46.02 120.89,46.02 R14.1 120.84,50.61 118.21,53.24 109.44,53.24 C6.2 107.3,53.78 105.05,56.03 63.75,56.03 v62.64,54.91 | v62.59,49.53 59.38,49.53 v50.14,40.28 | v35.05,40.34 U2.29
  Bottom 0.203: v62.64,54.91 62.64,51.26 62.28,50.9 62.28,49.84 v62.59,49.53 | v50.14,40.28 46.58,40.28 44.65,38.35 40.54,38.35 37.69,41.2 35.92,41.2 v35.05,40.34
RO  (via drill 0.3)
  Top 0.203: U2.30 34.25,44.7 | 34.25,44.7 34.25,44.81 U1.1 | J8.4 110.33,45.17 108.41,47.09 108.41,47.35 v107.09,48.67 | v105.97,57.4 105.97,57.66 105.11,58.52 29.87,58.52 26.98,55.63 26.98,53.54 v28.09,52.43 | v30.18,51.46 32.72,51.46 v32.77,51.41 | v35.66,46.23 35.66,46.12 34.25,44.7
  Bottom 0.203: v107.09,48.67 107.09,56.29 v105.97,57.4 | v28.09,52.43 29.21,52.43 v30.18,51.46 | v32.77,51.41 33.98,51.41 36.73,48.67 36.73,47.3 v35.66,46.23
SCK  (via drill 0.3)
  Top 0.152: 29.41,8.38 30.02,8.99
  Top 0.203: U4.5 29.69,8.66 30.02,8.99 30.79,9.75 30.79,13.01 32.31,14.53 33.17,14.53 33.78,15.14 v33.78,15.29 | v40.34,28.09 39.95,28.48 U2.17 | J9.3 122.12,40.79 v122.89,41.55 | v29.41,6.66 29.41,8.38
  Bottom 0.203: v33.78,15.29 33.98,15.29 36.78,18.09 40.79,18.09 44.7,22 44.7,26.67 43.28,28.09 v40.34,28.09 | v122.89,41.55 127.51,41.55 137.57,31.5 137.57,8.48 130.96,1.88 34.19,1.88 v29.41,6.66
SCL  (via drill 0.3)
  Top 0.203: v39.24,44.13 35.85,40.73 U2.28 | v48.39,44.26 57.34,53.21 100.9,53.21 105.92,48.2 105.93,48.2 106.48,47.65 106.48,36 107,35.48 v107,35.5 | v114.8,24.03 114.8,25.33 U3.5
  Bottom 0.203: v39.24,44.13 48.26,44.13 v48.39,44.26 | v107,35.5 113.25,35.5 114.25,34.5 114.25,25 114.8,24.45 v114.8,24.03
SDA  (via drill 0.3)
  Top 0.203: U3.4 v113.78,24.48 v113.78,24.47 | v48.45,42.86 57.53,51.94 100.2,51.94 105.59,46.56 v105.59,34.88 | v39.43,42.86 39.43,42.8 36.65,40.01 U2.27
  Bottom 0.203: 113.78,24.28 v113.78,24.47 113.78,33.72 112.75,34.75 105.7,34.75 v105.59,34.88 | v48.45,42.86 v39.43,42.86
SS  (via drill 0.3)
  Top 0.203: U4.6 28.88,9.93 29.62,10.67 29.62,12.7 v32.72,15.8 | v34.34,17.83 34.34,19.05 v34.59,19.3 | v36.63,23.06 36.63,27.87 U2.14 | R1.2 27.09,36.56 v26.87,36.78 | v20.62,27.84 24.69,27.84 v24.74,27.79
  Bottom 0.203: v32.72,15.8 32.72,16.2 v34.34,17.83 | v34.59,19.3 34.59,21.03 v36.63,23.06 35.36,24.33 34.7,24.33 31.24,27.79 v24.74,27.79 | v26.87,36.78 26.87,35.76 21.64,30.53 21.64,28.85 v20.62,27.84
T+
  Top 0.203: U4.3 16.24,9.93 TB1.2
T-
  Top 0.203: 21.94,11.33 U4.2 22.04,11.23 18.03,11.23 16.56,12.7 12.19,12.7 10.81,11.32 TB1.1
TACH1  (via drill 0.3)
  Top 0.203: U2.24 42.09,35.19 42.86,34.42 42.86,24.77 v40.51,22.42 40.51,19.02 38.96,17.48 v38.96,16.2 | v37.44,14.68 37.44,9.47 J2.3
  Bottom 0.203: v38.96,16.2 v37.44,14.68
TACH2  (via drill 0.3)
  Top 0.203: v45.28,39.94 45.28,24.83 v42.1,21.65 42.1,18.22 41.71,17.83 41.71,16.71 42.22,16.2 42.22,9.27 J3.3 | U2.25 38.25,38.88 v39.62,40.26
  Bottom 0.203: v39.62,40.26 44.96,40.26 v45.28,39.94
TACH3  (via drill 0.3)
  Top 0.203: v46.29,41.53 46.29,22.47 v46.37,22.39 | U2.26 37.45,39.41 v39.56,41.53 | v45.77,17.48 45.77,15.65 44.25,14.12 44.25,9.6 44.6,9.25 J4.3
  Bottom 0.203: v39.56,41.53 v46.29,41.53 | v46.37,22.39 46.37,18.07 v45.77,17.48
ULC_N  (via drill 0.3)
  Top 0.152: J1.8 15.78,36.54 16.87,37.62 18.21,37.62 22.38,41.78 29.01,41.78 v29.01,41.6 | v45.62,44.91 45.75,45.03 47.12,43.66 47.12,25.38 47.58,24.92 v47.45,24.79 | v50.39,23.32 50.39,23.5 53.52,23.5 54.2,22.81 v54.2,22.4 | R10.1 55.32,21.44 v55.12,21.64 58.13,21.64 R13.1
  Bottom 0.152: v29.01,41.6 29.01,41.78 35.48,41.78 38.88,45.19 45.6,45.19 45.75,45.03 v45.62,44.91 | v47.45,24.79 47.58,24.92 49,23.5 50.39,23.5 v50.39,23.32 | v54.2,22.4 54.97,21.64 v55.12,21.64
ULC_P  (via drill 0.3)
  Top 0.152: R11.1 56.43,19.71 54.22,19.71 R9.1 53.42,20.8 54.86,22.25 54.86,22.65 53.67,23.85 50.39,23.85 v50.39,24.03 | J1.7 16.3,38.54 16.87,37.97 18.06,37.97 22.23,42.14 29.01,42.14 v29.01,42.32 | v46.12,45.41 46,45.29 47.47,43.81 47.47,25.52 47.83,25.17 v47.95,25.3
  Top 0.203: 57.2,20.51 R11.1
  Bottom 0.152: v29.01,42.32 29.01,42.14 35.33,42.14 38.74,45.54 45.74,45.54 46,45.29 v46.12,45.41 | v47.95,25.3 47.83,25.17 49.15,23.85 50.39,23.85 v50.39,24.03
USB_N
  Top 0.152: R11.2 R13.2 | 57.25,18.89 54.94,16.57 54.94,9.8 55.81,8.93 J5.3
  Top 0.305: 57.25,18.89 R11.2
USB_P
  Top 0.152: R10.2 R9.2 | 53.39,18.89 54.59,17.69 54.59,9.8 53.81,9.03 J5.2
  Top 0.305: 53.39,18.89 R9.2
WS2812B  (via drill 0.3, 0.6)
  Top 0.203: J7.4 118.23,11.46 v118.21,11.48 | U2.12 35.05,23.87 34.65,23.47 34.65,22.5 38.15,19 38.15,5.64 39.42,4.37 v42.01,4.37
  Bottom 0.203: v118.21,11.48 111.15,11.48 108.1,8.43 64.67,8.43 60.6,4.37 v42.01,4.37
XTAL1
  Top 0.203: R8.1 C4.2 16.37,29.62 Q2.1 17.34,30.89 27.74,30.89 28.24,30.39 U2.7
XTAL2
  Top 0.203: R8.2 22.25,25.45 23.39,24.31 25.55,24.31 25.81,24.56 25.81,25.41 C5.2 25.77,28.72 | 25.77,28.72 Q2.2 | 25.77,28.72 25.87,28.62 25.95,28.7 28.04,28.7 28.93,29.59 U2.8

### Text on the board
tPlace: ECAM03 Rev-- | SSR | MOD TOOL | THERM | FAN1 | FAN2 | FAN3 | USB CAM | RINGLIGHT
tDocu: MILL THIS AREA